# Altium schematic sheet buck_regulator_5v_0603.SchDoc
size A
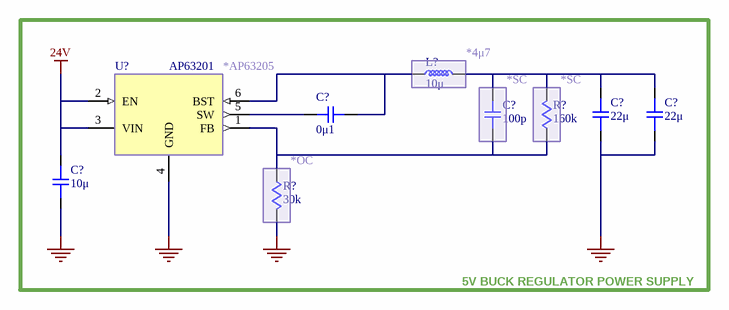
[diagram p0: buck_regulator_5v_0603.SchDoc]

## Parts
(Parts that share a designator on the sheet are numbered #1, #2 ... from top to bottom, then left to right.)
C?#1  0μ1  [cap_0603]
C?#2  100p  [cap_0603]
C?#3  22μ  [cap_0805_handsolder]
C?#4  22μ  [cap_0805_handsolder]
C?#5  10μ  [cap_0805_handsolder]
L?  10μ  [ind_aspi]
R?#1  160k  [res_0603]
R?#2  30k  [res_0603]
U?  AP63201  [ap6320x]

## Blocks framed on the sheet
*AP63205: U?

## Nets
24V: C?#5.2 U?.2(EN) U?.3(VIN)
GND: C?#3.1 C?#4.1 C?#5.1 R?#2.2 U?.4(GND)
NetC?#1_1: C?#1.1 U?.5(SW)
NetC?#1_2: C?#1.2 L?.1 U?.6(BST)
NetC?#2_1: C?#2.1 R?#1.1 R?#2.1 U?.1(FB)
NetC?#2_2: C?#2.2 C?#3.2 C?#4.2 L?.2 R?#1.2

## Notes on the sheet
- (near L?) *4μ7
- *SC
- (near R?#2) *OC
- 5V BUCK REGULATOR POWER SUPPLY

## Library data of the parts
C?#1 C?#2 = CAP_0603: Capacitor SMD 0603; Manufacturer: *; Manufacturer Part Number: *; Distributor Link: *; LCSC: *; Rating: *; Dielectric: *
C?#3-C?#5 = CAP_0805_handsolder: Capacitor SMD 0805 Hand Solder; Manufacturer: *; Manufacturer Part Number: *; Distributor Link: *; LCSC: *; Rating: *; Dielectric: *
L? = ind_aspi: Inductor Shielded Drum Core, Wirewound, Nonstandard
R?#1 R?#2 = res_0603: Resistor SMD 0603
U? = ap6320x